# EAGLE design usb-current-meter-8x (EAGLE 6.3)
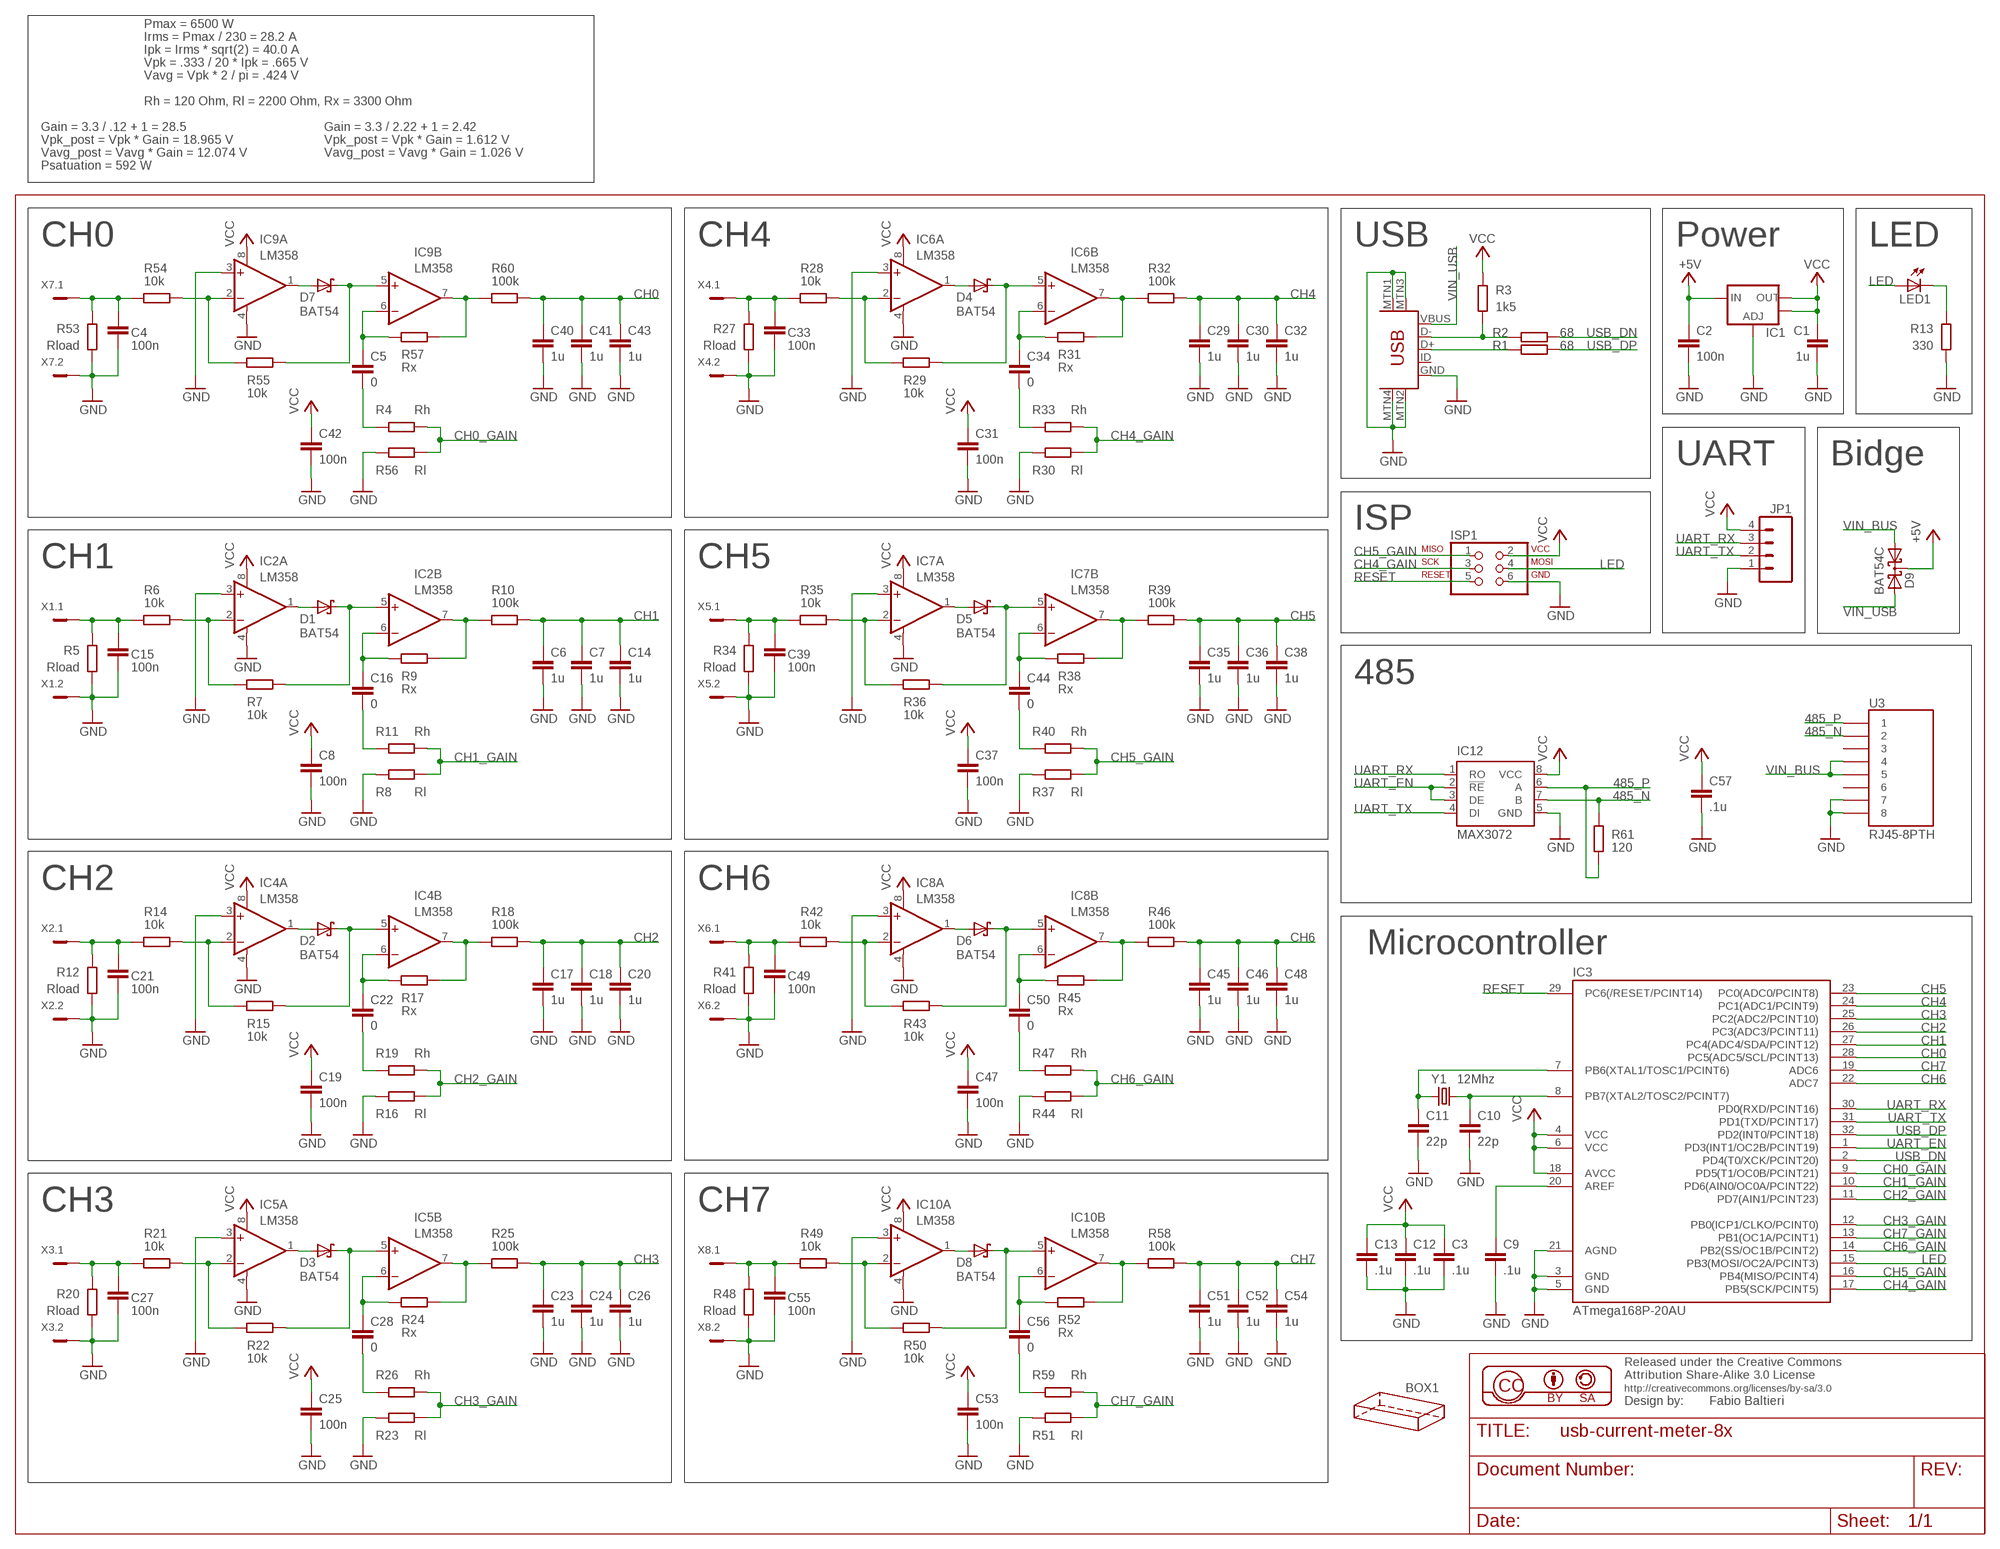
[diagram p0: schematic, sheet 1]

## Parts
BOX1  HAMMOND-BOX-XXA  [1591XXA]
C1  1u  C-EUC0805  [C0805]
C2  100n  C-EUC0805  [C0805]
C3  .1u  C-EUC0805  [C0805]
C4  100n  C-EUC0805  [C0805]
C5  0  C-EUC0805  [C0805]
C6  1u  C-EUC0805  [C0805]
C7  1u  C-EUC0805  [C0805]
C8  100n  C-EUC0805  [C0805]
C9  .1u  C-EUC0805  [C0805]
C10  22p  C-EUC0805  [C0805]
C11  22p  C-EUC0805  [C0805]
C12  .1u  C-EUC0805  [C0805]
C13  .1u  C-EUC0805  [C0805]
C14  1u  C-EUC0805  [C0805]
C15  100n  C-EUC0805  [C0805]
C16  0  C-EUC0805  [C0805]
C17  1u  C-EUC0805  [C0805]
C18  1u  C-EUC0805  [C0805]
C19  100n  C-EUC0805  [C0805]
C20  1u  C-EUC0805  [C0805]
C21  100n  C-EUC0805  [C0805]
C22  0  C-EUC0805  [C0805]
C23  1u  C-EUC0805  [C0805]
C24  1u  C-EUC0805  [C0805]
C25  100n  C-EUC0805  [C0805]
C26  1u  C-EUC0805  [C0805]
C27  100n  C-EUC0805  [C0805]
C28  0  C-EUC0805  [C0805]
C29  1u  C-EUC0805  [C0805]
C30  1u  C-EUC0805  [C0805]
C31  100n  C-EUC0805  [C0805]
C32  1u  C-EUC0805  [C0805]
C33  100n  C-EUC0805  [C0805]
C34  0  C-EUC0805  [C0805]
C35  1u  C-EUC0805  [C0805]
C36  1u  C-EUC0805  [C0805]
C37  100n  C-EUC0805  [C0805]
C38  1u  C-EUC0805  [C0805]
C39  100n  C-EUC0805  [C0805]
C40  1u  C-EUC0805  [C0805]
C41  1u  C-EUC0805  [C0805]
C42  100n  C-EUC0805  [C0805]
C43  1u  C-EUC0805  [C0805]
C44  0  C-EUC0805  [C0805]
C45  1u  C-EUC0805  [C0805]
C46  1u  C-EUC0805  [C0805]
C47  100n  C-EUC0805  [C0805]
C48  1u  C-EUC0805  [C0805]
C49  100n  C-EUC0805  [C0805]
C50  0  C-EUC0805  [C0805]
C51  1u  C-EUC0805  [C0805]
C52  1u  C-EUC0805  [C0805]
C53  100n  C-EUC0805  [C0805]
C54  1u  C-EUC0805  [C0805]
C55  100n  C-EUC0805  [C0805]
C56  0  C-EUC0805  [C0805]
C57  .1u  C-EUC0805  [C0805]
D1  BAT54  [SOT23]
D2  BAT54  [SOT23]
D3  BAT54  [SOT23]
D4  BAT54  [SOT23]
D5  BAT54  [SOT23]
D6  BAT54  [SOT23]
D7  BAT54  [SOT23]
D8  BAT54  [SOT23]
D9  BAT54C  [SOT23]
IC1  V_REG_LM1117SOT223  [SOT223]
IC2  LM358  OPA2234U  [SO08]
IC3  ATmega168P-20AU  MEGA48/88/168-AU  [TQFP32-08]
IC4  LM358  OPA2234U  [SO08]
IC5  LM358  OPA2234U  [SO08]
IC6  LM358  OPA2234U  [SO08]
IC7  LM358  OPA2234U  [SO08]
IC8  LM358  OPA2234U  [SO08]
IC9  LM358  OPA2234U  [SO08]
IC10  LM358  OPA2234U  [SO08]
IC12  MAX3072  LTC485S  [SOIC8]
ISP1  ISP-AVR910PTH  [2X03]
JP1  M04PTH  [1X04]
LED1  LEDSML0805  [SML0805]
R1  68  R-EU_R0603  [R0603]
R2  68  R-EU_R0603  [R0603]
R3  1k5  R-EU_R0603  [R0603]
R4  Rh  R-EU_R0603  [R0603]
R5  Rload  R-EU_R0805  [R0805]
R6  10k  R-EU_R0603  [R0603]
R7  10k  R-EU_R0603  [R0603]
R8  Rl  R-EU_R0603  [R0603]
R9  Rx  R-EU_R0603  [R0603]
R10  100k  R-EU_R0603  [R0603]
R11  Rh  R-EU_R0603  [R0603]
R12  Rload  R-EU_R0805  [R0805]
R13  330  R-EU_R0603  [R0603]
R14  10k  R-EU_R0603  [R0603]
R15  10k  R-EU_R0603  [R0603]
R16  Rl  R-EU_R0603  [R0603]
R17  Rx  R-EU_R0603  [R0603]
R18  100k  R-EU_R0603  [R0603]
R19  Rh  R-EU_R0603  [R0603]
R20  Rload  R-EU_R0805  [R0805]
R21  10k  R-EU_R0603  [R0603]
R22  10k  R-EU_R0603  [R0603]
R23  Rl  R-EU_R0603  [R0603]
R24  Rx  R-EU_R0603  [R0603]
R25  100k  R-EU_R0603  [R0603]
R26  Rh  R-EU_R0603  [R0603]
R27  Rload  R-EU_R0805  [R0805]
R28  10k  R-EU_R0603  [R0603]
R29  10k  R-EU_R0603  [R0603]
R30  Rl  R-EU_R0603  [R0603]
R31  Rx  R-EU_R0603  [R0603]
R32  100k  R-EU_R0603  [R0603]
R33  Rh  R-EU_R0603  [R0603]
R34  Rload  R-EU_R0805  [R0805]
R35  10k  R-EU_R0603  [R0603]
R36  10k  R-EU_R0603  [R0603]
R37  Rl  R-EU_R0603  [R0603]
R38  Rx  R-EU_R0603  [R0603]
R39  100k  R-EU_R0603  [R0603]
R40  Rh  R-EU_R0603  [R0603]
R41  Rload  R-EU_R0805  [R0805]
R42  10k  R-EU_R0603  [R0603]
R43  10k  R-EU_R0603  [R0603]
R44  Rl  R-EU_R0603  [R0603]
R45  Rx  R-EU_R0603  [R0603]
R46  100k  R-EU_R0603  [R0603]
R47  Rh  R-EU_R0603  [R0603]
R48  Rload  R-EU_R0805  [R0805]
R49  10k  R-EU_R0603  [R0603]
R50  10k  R-EU_R0603  [R0603]
R51  Rl  R-EU_R0603  [R0603]
R52  Rx  R-EU_R0603  [R0603]
R53  Rload  R-EU_R0805  [R0805]
R54  10k  R-EU_R0603  [R0603]
R55  10k  R-EU_R0603  [R0603]
R56  Rl  R-EU_R0603  [R0603]
R57  Rx  R-EU_R0603  [R0603]
R58  100k  R-EU_R0603  [R0603]
R59  Rh  R-EU_R0603  [R0603]
R60  100k  R-EU_R0603  [R0603]
R61  120  R-EU_R0603  [R0603]
U3  RJ45-8PTH  [RJ45-8]
U$1  USB-MINIB-5PIN  [USB-MINIB]
U$2  Fabio Baltieri  CREATIVE_COMMONS  [CREATIVE_COMMONS]
X1  MC2  [MC2]
X2  MC2  [MC2]
X3  MC2  [MC2]
X4  MC2  [MC2]
X5  MC2  [MC2]
X6  MC2  [MC2]
X7  MC2  [MC2]
X8  MC2  [MC2]
Y1  12Mhz  CRYSTALHC49UV  [HC49U-V]

## Nets
485_N: IC12.7(B) R61.1 U3.2
485_P: IC12.6(A) R61.2 U3.1
+5V: C2.1 D9.3(CC) IC1.3(IN)
CH0: C40.1 C41.1 C43.1 IC3.28(PC5(ADC5/SCL/PCINT13)) R60.2
CH0_GAIN: IC3.9(PD5(T1/OC0B/PCINT21)) R4.1 R56.2
CH0_IN: C4.1 R53.2 R54.1 X7.1
CH0_IN1: C15.1 R5.2 R6.1 X1.1
CH0_IN2: C21.1 R12.2 R14.1 X2.1
CH0_IN3: C33.1 R27.2 R28.1 X4.1
CH0_IN4: C39.1 R34.2 R35.1 X5.1
CH0_IN5: C55.1 R48.2 R49.1 X8.1
CH0_IN6: C27.1 R20.2 R21.1 X3.1
CH0_IN8: C49.1 R41.2 R42.1 X6.1
CH1: C6.1 C7.1 C14.1 IC3.27(PC4(ADC4/SDA/PCINT12)) R10.2
CH1_GAIN: IC3.10(PD6(AIN0/OC0A/PCINT22)) R8.2 R11.1
CH2: C17.1 C18.1 C20.1 IC3.26(PC3(ADC3/PCINT11)) R18.2
CH2_GAIN: IC3.11(PD7(AIN1/PCINT23)) R16.2 R19.1
CH3: C23.1 C24.1 C26.1 IC3.25(PC2(ADC2/PCINT10)) R25.2
CH3_GAIN: IC3.12(PB0(ICP1/CLKO/PCINT0)) R23.2 R26.1
CH4: C29.1 C30.1 C32.1 IC3.24(PC1(ADC1/PCINT9)) R32.2
CH4_GAIN: IC3.17(PB5(SCK/PCINT5)) ISP1.3 R30.2 R33.1
CH5: C35.1 C36.1 C38.1 IC3.23(PC0(ADC0/PCINT8)) R39.2
CH5_GAIN: IC3.16(PB4(MISO/PCINT4)) ISP1.1 R37.2 R40.1
CH6: C45.1 C46.1 C48.1 IC3.22(ADC7) R46.2
CH6_GAIN: IC3.14(PB2(SS/OC1B/PCINT2)) R44.2 R47.1
CH7: C51.1 C52.1 C54.1 IC3.19(ADC6) R58.2
CH7_GAIN: IC3.13(PB1(OC1A/PCINT1)) R51.2 R59.1
GND: C1.2 C2.2 C3.2 C4.2 C6.2 C7.2 C8.2 C9.2 C10.2 C11.2 C12.2 C13.2 C14.2 C15.2 C17.2 C18.2 C19.2 C20.2 C21.2 C23.2 C24.2 C25.2 C26.2 C27.2 C29.2 C30.2 C31.2 C32.2 C33.2 C35.2 C36.2 C37.2 C38.2 C39.2 C40.2 C41.2 C42.2 C43.2 C45.2 C46.2 C47.2 C48.2 C49.2 C51.2 C52.2 C53.2 C54.2 C55.2 C57.2 IC1.1(ADJ) IC2.3(A:+IN) IC2.4(A:V-) IC3.3(GND) IC3.5(GND) IC3.21(AGND) IC4.3(A:+IN) IC4.4(A:V-) IC5.3(A:+IN) IC5.4(A:V-) IC6.3(A:+IN) IC6.4(A:V-) IC7.3(A:+IN) IC7.4(A:V-) IC8.3(A:+IN) IC8.4(A:V-) IC9.3(A:+IN) IC9.4(A:V-) IC10.3(A:+IN) IC10.4(A:V-) IC12.5(GND) ISP1.6 JP1.1 R5.1 R8.1 R12.1 R13.1 R16.1 R20.1 R23.1 R27.1 R30.1 R34.1 R37.1 R41.1 R44.1 R48.1 R51.1 R53.1 R56.1 U3.7 U3.8 U$1.GND U$1.MTN1(MTN2) U$1.MTN2(MTN3) U$1.MTN3(MTN1) U$1.MTN4 X1.2 X2.2 X3.2 X4.2 X5.2 X6.2 X7.2 X8.2
LED: IC3.15(PB3(MOSI/OC2A/PCINT3)) ISP1.4 LED1.A
N$1: R2.1 R3.1 U$1.D-
N$2: R1.1 U$1.D+
N$3: LED1.C R13.2
N$4: C11.1 IC3.7(PB6(XTAL1/TOSC1/PCINT6)) Y1.1
N$5: C10.1 IC3.8(PB7(XTAL2/TOSC2/PCINT7)) Y1.2
N$6: C9.1 IC3.20(AREF)
N$7: C5.2 R4.2
N$8: IC2.2(A:-IN) R6.2 R7.1
N$9: D1.1(A) IC2.1(A:OUT)
N$10: D1.3(C) IC2.5(B:+IN) R7.2
N$11: C16.1 IC2.6(B:-IN) R9.1
N$12: IC2.7(B:OUT) R9.2 R10.1
N$13: C16.2 R11.2
N$14: IC4.2(A:-IN) R14.2 R15.1
N$15: D2.1(A) IC4.1(A:OUT)
N$16: D2.3(C) IC4.5(B:+IN) R15.2
N$17: C22.1 IC4.6(B:-IN) R17.1
N$18: IC4.7(B:OUT) R17.2 R18.1
N$19: C22.2 R19.2
N$20: IC6.2(A:-IN) R28.2 R29.1
N$21: D4.1(A) IC6.1(A:OUT)
N$22: D4.3(C) IC6.5(B:+IN) R29.2
N$23: C34.1 IC6.6(B:-IN) R31.1
N$24: IC6.7(B:OUT) R31.2 R32.1
N$25: C34.2 R33.2
N$26: IC7.2(A:-IN) R35.2 R36.1
N$27: D5.1(A) IC7.1(A:OUT)
N$28: D5.3(C) IC7.5(B:+IN) R36.2
N$29: C44.1 IC7.6(B:-IN) R38.1
N$30: IC7.7(B:OUT) R38.2 R39.1
N$31: C44.2 R40.2
N$32: IC10.2(A:-IN) R49.2 R50.1
N$33: D8.1(A) IC10.1(A:OUT)
N$34: D8.3(C) IC10.5(B:+IN) R50.2
N$35: C56.1 IC10.6(B:-IN) R52.1
N$36: IC10.7(B:OUT) R52.2 R58.1
N$37: IC9.2(A:-IN) R54.2 R55.1
N$38: D7.1(A) IC9.1(A:OUT)
N$39: D7.3(C) IC9.5(B:+IN) R55.2
N$40: C5.1 IC9.6(B:-IN) R57.1
N$41: IC9.7(B:OUT) R57.2 R60.1
N$42: C56.2 R59.2
N$43: IC5.2(A:-IN) R21.2 R22.1
N$44: D3.1(A) IC5.1(A:OUT)
N$45: D3.3(C) IC5.5(B:+IN) R22.2
N$46: C28.1 IC5.6(B:-IN) R24.1
N$47: IC5.7(B:OUT) R24.2 R25.1
N$48: C28.2 R26.2
N$55: IC8.2(A:-IN) R42.2 R43.1
N$56: D6.1(A) IC8.1(A:OUT)
N$57: D6.3(C) IC8.5(B:+IN) R43.2
N$58: C50.1 IC8.6(B:-IN) R45.1
N$59: IC8.7(B:OUT) R45.2 R46.1
N$60: C50.2 R47.2
RESET: IC3.29(PC6(/RESET/PCINT14)) ISP1.5
UART_EN: IC3.1(PD3(INT1/OC2B/PCINT19)) IC12.2(!RE) IC12.3(DE)
UART_RX: IC3.30(PD0(RXD/PCINT16)) IC12.1(RO) JP1.3
UART_TX: IC3.31(PD1(TXD/PCINT17)) IC12.4(DI) JP1.2
USB_DN: IC3.2(PD4(T0/XCK/PCINT20)) R2.2
USB_DP: IC3.32(PD2(INT0/PCINT18)) R1.2
VCC: C1.1 C3.1 C8.1 C12.1 C13.1 C19.1 C25.1 C31.1 C37.1 C42.1 C47.1 C53.1 C57.1 IC1.2(OUT) IC1.4(OUT) IC2.8(A:V+) IC3.4(VCC) IC3.6(VCC) IC3.18(AVCC) IC4.8(A:V+) IC5.8(A:V+) IC6.8(A:V+) IC7.8(A:V+) IC8.8(A:V+) IC9.8(A:V+) IC10.8(A:V+) IC12.8(VCC) ISP1.2 JP1.4 R3.2
VIN_BUS: D9.1(A1) U3.4 U3.5
VIN_USB: D9.2(A2) U$1.VBUS
Unconnected: U3.3 U3.6 U$1.ID

## Notes on the sheet
- Pmax = 6500 W
- Irms = Pmax / 230 = 28.2 A
- Ipk = Irms * sqrt(2) = 40.0 A
- Vpk = .333 / 20 * Ipk = .665 V
- Vavg = Vpk * 2 / pi = .424 V
- Rh = 120 Ohm, Rl = 2200 Ohm, Rx = 3300 Ohm
- Gain = 3.3 / .12 + 1 = 28.5 | Gain = 3.3 / 2.22 + 1 = 2.42
- Vpk_post = Vpk * Gain = 18.965 V | Vpk_post = Vpk * Gain = 1.612 V
- Vavg_post = Vavg * Gain = 12.074 V | Vavg_post = Vavg * Gain = 1.026 V
- Psatuation = 592 W
- CH0 | CH4 | USB | Power | LED
- UART | Bidge
- ISP
- CH1 | CH5
- 485
- CH2 | CH6
- Microcontroller
- CH3 | CH7

## Library data of the parts
BOX1 = hammond:HAMMOND-BOX: Hammond Project boxes Hammond 1551 Transluscent Blue 50x35x20mm 1551GTBU http://www.hammondmfg.com/pdf/1551G.pdf Hammond 1551 Transluscent Blue 50x50x20mm 1551RTBU http://www.hammondmfg.com/pdf/1551R.pdf Hammond 1551 Transluscent Blue 60x35x20mm 1551HTBU http://www.hammondmfg.com/pdf/1551H.pdf Hammond 1551 Transluscent Blue 80x40x20mm 1551KTBU http://www.hammondmfg.com/pdf/1551K.pdf Hammond 1591 Transluscent Blue 100x51x22m m 1591XXATBU http://www.hammondmfg.com/pdf/1591XXA.pdf
C1-C57 = rcl:C-EU: CAPACITOR, European symbol
D1-D8 = diode:BAT54: Schottky Diodes Source: Fairchild .. BAT54.pdf
D9 = diode:BAT54C: Schottky Diodes Source: Fairchild .. BAT54.pdf
IC1 = SparkFun:V_REG_LM1117: Voltage Regulator LM1117 Standard adjustable voltage regulator but in SMD form. Spark Fun Electronics SKU : COM-00595
IC2 IC4-IC10 = burr-brown:OPA2234: Operational Amplifier; MF: TEXAS INSTRUMENTS; MPN: OPA2234U; OC_FARNELL: 1212441; OC_NEWARK: 96K4523
IC3 = avr-5:MEGA48/88/168
IC12 = linear-technology:LTC485: Low Power RS485 Interface Transceiver Source: http://www.linear.com/pc/downloadDocument.do?navId=H0,C1,C1007,C1017,P2064,D1718; OC_FARNELL: unknown; OC_NEWARK: unknown
ISP1 = balto:ISP-AVR910: PIN HEADER
JP1 = SparkFun-Connectors:M04: Header 4 Standard 4-pin 0.1" header. Use with straight break away headers (SKU : PRT-00116), right angle break away headers (PRT-00553), swiss pins (PRT-00743), machine pins (PRT-00117), and female headers (PRT-00115). Molex polarized connector foot print use with SKU : PRT-08231 with associated crimp pins and housings. 1MM SMD Version SKU: PRT-10208
LED1 = led:LED: LED OSRAM: - CHIPLED LG R971, LG N971, LY N971, LG Q971, LY Q971, LO R971, LY R971 LH N974, LH R974 LS Q976, LO Q976, LY Q976 LO Q996 - Hyper CHIPLED LW Q18S LB Q993, LB Q99A, LB R99A - SideLED LS A670, LO A670, LY A670, LG A670, LP A670 LB A673, LV A673, LT A673, LW A673 LH A674 LY A675 LS A676, LA A676, LO A676, LY A676, LW A676 LS A679, LY A679, LG A679 - Hyper Micro SIDELED® LS Y876, LA Y876, LO Y876, LY Y876 LT Y87S - SmartLED LW L88C, LW L88S LB L89C, LB L89S, LG L890 LS L89K, LO L89K, LY L89K LS L896, LA L896, LO L896, LY L896 - TOPLED LS T670, LO T670, LY T670, LG T670, LP T670 LSG T670, LSP T670, LSY T670, LOP T670, LYG T670 LG T671, LOG T671, LSG T671 LB T673, LV T673, LT T673, LW T673 LH T674 LS T676, LA T676, LO T676, LY T676, LB T676, LH T676, LSB T676, LW T676 LB T67C, LV T67C, LT T67C, LS T67K, LO T67K, LY T67K, LW E67C LS E67B, LA E67B, LO E67B, LY E67B, LB E67C, LV E67C, LT E67C LW T67C LS T679, LY T679, LG T679 LS T770, LO T770, LY T770, LG T770, LP T770 LB T773, LV T773, LT T773, LW T773 LH T774 LS E675, LA E675, LY E675, LS T675 LS T776, LA T776, LO T776, LY T776, LB T776 LHGB T686 LT T68C, LB T68C - Hyper Mini TOPLED® LB M676 - Mini TOPLED Santana® LG M470 LS M47K, LO M47K, LY M47K Source: http://www.osram.convergy.de LUXEON: - LUMILED® LXK2-PW12-R00, LXK2-PW12-S00, LXK2-PW14-U00, LXK2-PW14-V00 LXK2-PM12-R00, LXK2-PM12-S00, LXK2-PM14-U00 LXK2-PE12-Q00, LXK2-PE12-R00, LXK2-PE12-S00, LXK2-PE14-T00, LXK2-PE14-U00 LXK2-PB12-K00, LXK2-PB12-L00, LXK2-PB12-M00, LXK2-PB14-N00, LXK2-PB14-P00, LXK2-PB14-Q00 LXK2-PR12-L00, LXK2-PR12-M00, LXK2-PR14-Q00, LXK2-PR14-R00 LXK2-PD12-Q00, LXK2-PD12-R00, LXK2-PD12-S00 LXK2-PH12-R00, LXK2-PH12-S00 LXK2-PL12-P00, LXK2-PL12-Q00, LXK2-PL12-R00 Source: www.luxeon.com KINGBRIGHT: KA-3528ASYC Source: www.kingbright.com
R1-R61 = rcl:R-EU_: RESISTOR, European symbol
U3 = SparkFun-Connectors:RJ45-8: RJ45 Jack Simple RJ45, 8-pin connection - connector for common Cat5, Cat5e, and Cat6 Ethernet cables. Footprint not yet proven in production. Connector sku is PRT-00643; Breakout PCB sku is BOB-00716.
U$1 = SparkFun:USB-MINIB: Mini-USB "B" connector with 5th pin broken out. Created new symbol breaking out 5th "ID" pin in mini/micro USB connector spec. See: http://en.wikipedia.org/wiki/Mini_usb#Cables. Uses same footprint as 4-pin symbol. Also added pins to connect to mounting / shield pads if required (probably not generally needed as signals aren't shielded once they leave the connector).
U$2 = balto:CREATIVE_COMMONS
X1-X8 = con-phoenix-381_l:MC2: Mini-Combicon 3.81mm horizontal 2-polig MC 1,5/2-G-3,81 Artikel-Nr. 1803277
Y1 = SparkFun:CRYSTAL: Crystals Various standard crystals. Proven footprints. Spark Fun Electronics SKU : COM-00534

## Board
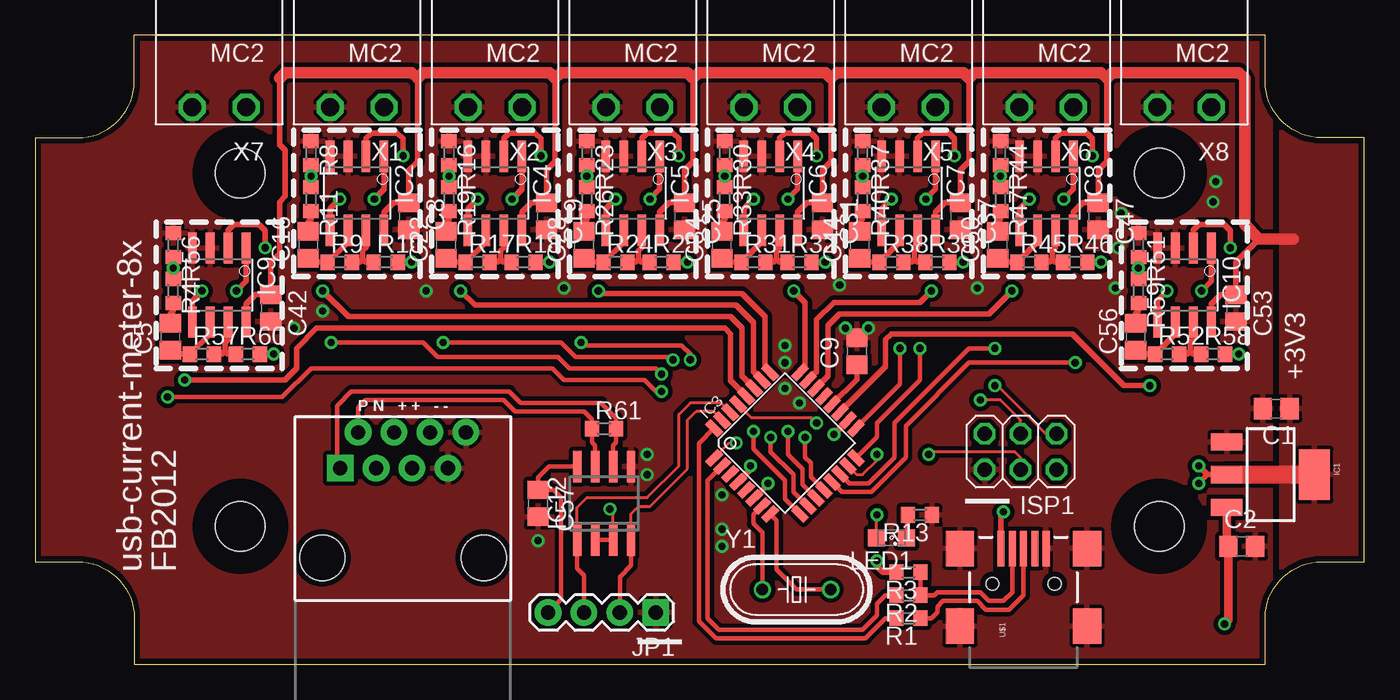
[diagram p1: board, top side]
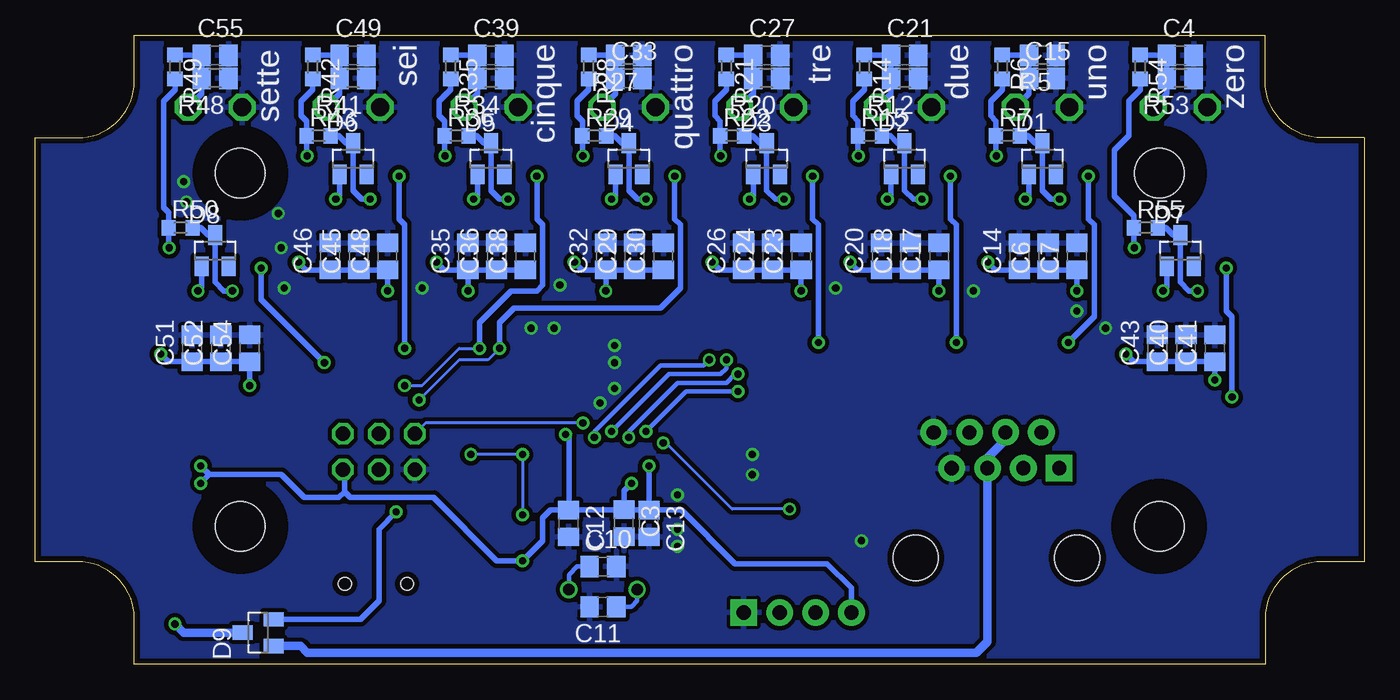
[diagram p2: board, bottom side, seen from below]

Size 94 x 44.5 mm. Coordinates in mm from the lower left corner, seen from the top.
Copper layers (1*16): Top 0.035mm / dielectric 1.5mm / Bottom 0.035mm
Design rules "default": minimum track width 8mil, minimum drill 20mil, track to track 8mil, track to pad 8mil, pad to pad 8mil, via to via 8mil, smd to smd 8mil, copper to edge 16mil, drill to drill 8mil, minimum pad ring 8mil, minimum via ring 8mil, stop-mask expansion 4mil, vias tented up to drill 20mil, thermal gap 10mil

### Footprints (pad centres in the part's own frame; a part is rotated, then mirrored left to right if it is on the bottom)
1591XXA = hole 3.5: 79.5,9.75; 14.5,34.75; 79.5,34.75; 14.5,9.75
C0805 = smd 1.3 x 1.5: 1 -0.95,0; 2 0.95,0
SOT23 = smd 1 x 1.4: 1 -0.95,-1.1; 2 0.95,-1.1; 3 0,1.1
SOT223 = smd 1.219 x 2.235: 1 -2.311,-3.099; 2 0,-3.099; 3 2.311,-3.099 | smd 3.6 x 2.2: 4 0,3.099
SO08 = smd 0.61 x 2.21: 1 -1.905,-2.616; 2 -0.635,-2.616; 3 0.635,-2.616; 4 1.905,-2.616; 5 1.905,2.616; 6 0.635,2.616; 7 -0.635,2.616; 8 -1.905,2.616
TQFP32-08 = smd 1.27 x 0.559: 1 -4.293,2.8; 2 -4.293,2; 3 -4.293,1.2; 4 -4.293,0.4; 5 -4.293,-0.4; 6 -4.293,-1.2; 7 -4.293,-2; 8 -4.293,-2.8; 17 4.293,-2.8; 18 4.293,-2; 19 4.293,-1.2; 20 4.293,-0.4; 21 4.293,0.4; 22 4.293,1.2; 23 4.293,2; 24 4.293,2.8 | smd 0.559 x 1.27: 9 -2.8,-4.293; 10 -2,-4.293; 11 -1.2,-4.293; 12 -0.4,-4.293; 13 0.4,-4.293; 14 1.2,-4.293; 15 2,-4.293; 16 2.8,-4.293; 25 2.8,4.293; 26 2,4.293; 27 1.2,4.293; 28 0.4,4.293; 29 -0.4,4.293; 30 -1.2,4.293; 31 -2,4.293; 32 -2.8,4.293
SOIC8 = smd 0.6 x 2.2: 1 -1.905,-2.6; 2 -0.635,-2.6; 3 0.635,-2.6; 4 1.905,-2.6; 5 1.905,2.6; 6 0.635,2.6; 7 -0.635,2.6; 8 -1.905,2.6
2X03 = drill 1.016 octagon: 1 -2.54,-1.27; 2 -2.54,1.27; 3 0,-1.27; 4 0,1.27; 5 2.54,-1.27; 6 2.54,1.27
1X04 = drill 1.016 pad 1.88 square: 1 0,0 | drill 1.016 pad 1.88: 2 2.54,0; 3 5.08,0; 4 7.62,0
SML0805 = smd 1.2 x 1.2: A 1.05,0; C -1.05,0
R0603 = smd 1 x 1.1: 1 -0.85,0; 2 0.85,0
R0805 = smd 1.3 x 1.5: 1 -0.95,0; 2 0.95,0
RJ45-8 = drill 1 pad 1.88 square: 1 -4.445,6.35 | drill 1 pad 1.88: 2 -3.175,8.89; 3 -1.905,6.35; 4 -0.635,8.89; 5 0.635,6.35; 6 1.905,8.89; 7 3.175,6.35; 8 4.445,8.89 | hole 3.2: -5.715,0; 5.715,0
USB-MINIB = smd 2.5 x 0.5: D+ 2.5,0; D- 2.5,0.8; GND 2.5,-1.6; ID 2.5,-0.8; VBUS 2.5,1.6 | smd 2.5 x 2: MTN1 -3,4.5; MTN2 2.5,4.5; MTN3 -3,-4.5; MTN4 2.5,-4.5 | hole 0.9: 0,2.2; 0,-2.2
MC2 = drill 1.27 octagon: 1 -1.905,0; 2 1.905,0
HC49U-V = drill 0.813: 1 -2.413,0; 2 2.413,0

### Placement (x,y rotation side)
BOX1  0,0 0 top
C1  87.78,18.08 180 top
C2  85.34,8.33 0 top
C3  52.37,9.98 270 bottom
C4  13,43.08 0 bottom
C5  9.55,23.16 90 top
C6  22.35,28.85 90 bottom
C7  20.32,28.85 90 bottom
C8  26.42,31.7 270 top
C9  58.12,22.15 90 top
C10  53.85,6.91 0 bottom
C11  53.85,4.06 180 bottom
C12  56.29,9.96 270 bottom
C13  50.6,9.96 270 bottom
C14  24.38,28.85 90 bottom
C15  22.76,41.45 0 bottom
C16  19.3,29.67 90 top
C17  30.07,28.85 90 bottom
C18  32.11,28.85 90 bottom
C19  36.17,31.7 270 top
C20  34.14,28.85 90 bottom
C21  32.51,43.08 0 bottom
C22  29.06,29.67 90 top
C23  39.83,28.85 90 bottom
C24  41.86,28.85 90 bottom
C25  45.92,31.7 270 top
C26  43.89,28.85 90 bottom
C27  42.27,43.08 0 bottom
C28  38.81,29.67 90 top
C29  51.61,28.85 90 bottom
C30  49.58,28.85 90 bottom
C31  55.68,31.7 270 top
C32  53.64,28.85 90 bottom
C33  52.02,41.45 0 bottom
C34  48.56,29.67 90 top
C35  63.4,28.85 90 bottom
C36  61.37,28.85 90 bottom
C37  65.43,31.7 270 top
C38  59.33,28.85 90 bottom
C39  61.77,43.08 0 bottom
C40  12.6,22.35 90 bottom
C41  10.57,22.35 90 bottom
C42  16.66,25.2 270 top
C43  14.63,22.35 90 bottom
C44  58.32,29.67 90 top
C45  71.12,28.85 90 bottom
C46  73.15,28.85 90 bottom
C47  75.18,31.7 270 top
C48  69.09,28.85 90 bottom
C49  71.53,43.08 0 bottom
C50  68.07,29.67 90 top
C51  82.91,22.35 90 bottom
C52  80.87,22.35 90 bottom
C53  84.94,25.2 270 top
C54  78.84,22.35 90 bottom
C55  81.28,43.08 0 bottom
C56  77.83,23.16 90 top
C57  35.56,11.38 270 top
D1  22.76,35.76 0 bottom
D2  32.51,35.76 0 bottom
D3  42.27,35.76 0 bottom
D4  52.02,35.76 0 bottom
D5  61.77,35.76 0 bottom
D6  71.53,35.76 0 bottom
D7  13,29.26 0 bottom
D8  81.28,29.26 0 bottom
D9  78.23,2.24 90 bottom
IC1  87.38,13.41 270 top
IC2  22.76,33.32 180 top
IC3  53.04,15.65 45 top
IC4  32.51,33.32 180 top
IC5  42.27,33.32 180 top
IC6  52.02,33.32 180 top
IC7  61.77,33.32 180 top
IC8  71.53,33.32 180 top
IC9  13,26.82 180 top
IC10  81.28,26.82 180 top
IC12  40.23,11.38 0 top
ISP1  69.7,15.04 180 top
JP1  43.89,3.66 180 top
LED1  60.55,8.94 180 top
R1  61.77,3.25 180 top
R2  61.77,4.88 180 top
R3  61.77,6.5 180 top
R4  9.75,26.42 270 top
R5  22.76,43.08 180 bottom
R6  25.6,42.27 270 bottom
R7  25.2,37.39 0 bottom
R8  19.51,36.17 270 top
R9  21.54,28.45 0 top
R10  24.79,28.45 0 top
R11  19.51,32.92 270 top
R12  32.51,41.45 180 bottom
R13  62.59,10.57 180 top
R14  35.36,42.27 270 bottom
R15  34.95,37.39 0 bottom
R16  29.26,36.17 270 top
R17  31.29,28.45 0 top
R18  34.54,28.45 0 top
R19  29.26,32.92 270 top
R20  42.27,41.45 180 bottom
R21  45.11,42.27 270 bottom
R22  44.7,37.39 0 bottom
R23  39.01,36.17 270 top
R24  41.05,28.45 0 top
R25  44.3,28.45 0 top
R26  39.01,32.92 270 top
R27  52.02,43.08 180 bottom
R28  54.86,42.27 270 bottom
R29  54.46,37.39 0 bottom
R30  48.77,36.17 270 top
R31  50.8,28.45 0 top
R32  54.05,28.45 0 top
R33  48.77,32.92 270 top
R34  61.77,41.45 180 bottom
R35  64.62,42.27 270 bottom
R36  64.21,37.39 0 bottom
R37  58.52,36.17 270 top
R38  60.55,28.45 0 top
R39  63.8,28.45 0 top
R40  58.52,32.92 270 top
R41  71.53,41.45 180 bottom
R42  74.37,42.27 270 bottom
R43  73.96,37.39 0 bottom
R44  68.28,36.17 270 top
R45  70.31,28.45 0 top
R46  73.56,28.45 0 top
R47  68.28,32.92 270 top
R48  81.28,41.45 180 bottom
R49  84.12,42.27 270 bottom
R50  83.72,30.89 0 bottom
R51  78.03,29.67 270 top
R52  80.06,21.95 0 top
R53  13,41.45 180 bottom
R54  15.85,42.27 270 bottom
R55  15.44,30.89 0 bottom
R56  9.75,29.67 270 top
R57  11.79,21.95 0 top
R58  83.31,21.95 0 top
R59  78.03,26.42 270 top
R60  15.04,21.95 0 top
R61  40.23,16.66 0 top
U3  26.01,7.52 0 top
U$1  69.9,5.69 90 top
U$2  8.33,1.22 0 top
X1  22.76,39.42 180 top
X2  32.51,39.42 180 top
X3  42.27,39.42 180 top
X4  52.02,39.42 180 top
X5  61.77,39.42 180 top
X6  71.53,39.42 180 top
X7  13,39.42 180 top
X8  81.28,39.42 180 top
Y1  53.85,5.28 0 top

### Tracks (layer width: path | path; a pad name or v marks a point on that pad's centre or on a via)
485_N
  Top 0.305: IC12.7 39.6,15.47 39.38,15.68 R61.1 39.38,17.31 38.81,17.88 33.93,17.88 33.12,18.69 23.37,18.69 22.84,18.16 U3.2
485_P
  Top 0.305: IC12.6 40.87,15.47 41.08,15.68 R61.2 41.08,17.44 40.03,18.49 34.34,18.49 33.53,19.3 22.35,19.3 21.34,18.29 21.34,14.1 U3.1
+5V  (via drill 0.51)
  Top 0.61: IC1.3 84.28,8.45 C2.1 84.39,3.11 v84.12,2.85
  Bottom 0.61: D9.3 83.52,2.23 v84.12,2.85
CH0  (via drill 0.51)
  Top 0.406: v16.87,21.95 R60.2 | IC3.28 49.17,20.07 49.17,23.37 48.77,23.77 19.91,23.77 18.49,22.35 18.49,20.93 17.68,20.12 v10.57,20.12
  Bottom 0.406: v16.87,21.95 16.32,21.4 C43.1 C40.1 C41.1 v10.57,20.12
CH0_GAIN  (via drill 0.51)
  Top 0.305: IC3.9 53.03,11.69 53.03,13.01 50.8,15.24 v50.8,16.46 | v44.3,19.3 43.89,19.3 43.08,20.12 37.39,20.12 36.58,20.93 19.51,20.93 17.48,18.9 v9.35,18.9
  Top 0.406: R4.1 v9.75,28.04 R56.2
  Bottom 0.305: v50.8,16.46 47.95,19.3 v44.3,19.3
  Bottom 0.406: v9.75,28.04 9.75,24.99 9.35,24.59 v9.35,18.9
CH0_IN
  Bottom 0.406: X7.1 13.96,40.38 R53.2 C4.1 15.81,43.08 R54.1
CH0_IN1
  Bottom 0.406: X1.1 23.71,40.38 C15.1 R5.2 25.6,43.08 R6.1
CH0_IN2
  Bottom 0.406: X2.1 33.46,40.38 R12.2 C21.1 35.36,43.08 R14.1
CH0_IN3
  Bottom 0.406: X4.1 52.97,40.38 C33.1 R27.2 54.86,43.08 R28.1
CH0_IN4
  Bottom 0.406: X5.1 62.72,40.38 R34.2 C39.1 64.62,43.08 R35.1
CH0_IN5
  Bottom 0.406: X8.1 82.23,40.38 R48.2 C55.1 84.12,43.08 R49.1
CH0_IN6
  Bottom 0.406: X3.1 43.22,40.38 R20.2 C27.1 45.11,43.08 R21.1
CH0_IN8
  Bottom 0.406: X6.1 72.48,40.38 R41.2 C49.1 74.37,43.08 R42.1
CH1  (via drill 0.51)
  Top 0.406: v26.62,28.45 R10.2 | v20.32,26.42 22.15,24.59 49.17,24.59 49.99,23.77 49.99,20.39 IC3.27
  Bottom 0.406: v26.62,28.45 26.08,27.9 C14.1 C6.1 C7.1 v20.32,26.42
CH1_GAIN  (via drill 0.51)
  Top 0.305: IC3.10 53.65,12.21 53.65,13.41 52.02,15.04 v52.02,16.05 | v44.3,20.52 43.89,20.93 37.8,20.93 36.98,21.74 28.45,21.74 27.43,22.76 v20.93,22.76
  Top 0.406: R11.1 v19.51,34.54 R8.2
  Bottom 0.305: v44.3,20.52 44.5,20.52 45.11,19.91 48.56,19.91 52.02,16.46 v52.02,16.05
  Bottom 0.406: v19.51,34.54 19.51,31.5 19.1,31.09 19.1,24.59 v20.93,22.76
CH2  (via drill 0.51)
  Top 0.406: v36.37,28.45 R18.2 | v30.07,26.42 31.09,25.4 49.58,25.4 50.8,24.18 50.8,20.71 IC3.26
  Bottom 0.406: v36.37,28.45 35.83,27.9 C20.1 C18.1 C17.1 v30.07,26.42
CH2_GAIN  (via drill 0.51)
  Top 0.305: IC3.11 54.25,12.73 54.25,13.82 53.24,14.83 v53.24,16.46 | v45.11,21.54 44.91,21.74 38.2,21.74 37.19,22.76 v28.85,22.76
  Top 0.406: R19.1 v29.26,34.54 R16.2
  Bottom 0.305: v53.24,16.46 49.17,20.52 45.52,20.52 45.11,20.93 v45.11,21.54
  Bottom 0.406: v29.26,34.54 29.26,31.5 28.85,31.09 v28.85,22.76
CH3  (via drill 0.51)
  Top 0.406: v46.13,28.45 R25.2 | v39.83,26.42 40.03,26.21 49.99,26.21 51.61,24.59 51.61,21.03 IC3.25
  Bottom 0.406: v46.13,28.45 45.58,27.9 C26.1 C24.1 C23.1 v39.83,26.42
CH3_GAIN  (via drill 0.51)
  Top 0.305: IC3.12 54.86,13.25 54.86,14.22 54.46,14.63 v54.46,16.05 | v46.33,21.54 46.33,21.95 45.72,22.55 38.81,22.55 v38.61,22.76
  Top 0.406: R26.1 v39.01,34.54 R23.2
  Bottom 0.305: v54.46,16.05 54.46,16.46 49.78,21.13 46.74,21.13 v46.33,21.54
  Bottom 0.406: v39.01,34.54 39.01,31.5 38.61,31.09 v38.61,22.76
CH4  (via drill 0.51)
  Top 0.406: v55.88,28.45 R32.2 | IC3.24 54.46,21.03 54.46,25.6 v53.65,26.42
  Bottom 0.406: C32.1 C29.1 C30.1 | C32.1 55.34,27.9 v55.88,28.45 | C32.1 v53.65,26.42
CH4_GAIN  (via drill 0.51)
  Top 0.203: ISP1.3 69.7,17.27 68.28,18.69 v66.85,18.69
  Top 0.305: IC3.17 61.16,19.82 v61.16,22.35
  Top 0.406: R33.1 v48.77,34.54 R30.2
  Bottom 0.203: v61.16,22.35 61.98,21.54 64.01,21.54 v66.85,18.69
  Bottom 0.406: v48.77,34.54 48.77,31.5 48.36,31.09 48.36,26.62 49.78,25.2 60.15,25.2 61.16,24.18 v61.16,22.35
CH5  (via drill 0.51)
  Top 0.406: v65.63,28.45 R39.2 | IC3.23 55.27,20.71 55.27,24.38 56.49,25.6 62.59,25.6 v63.4,26.42
  Bottom 0.406: C35.1 C36.1 C38.1 | C35.1 65.09,27.9 v65.63,28.45 | v63.4,26.42 C35.1
CH5_GAIN  (via drill 0.51)
  Top 0.203: v67.87,19.71 68.07,19.71 71.48,16.31 ISP1.1
  Top 0.305: IC3.16 59.54,16.08 59.54,17.07 62.59,20.12 v62.59,22.35
  Top 0.406: R40.1 v58.52,34.54 R37.2
  Bottom 0.203: v67.87,19.71 66.65,19.71 64.01,22.35 v62.59,22.35
  Bottom 0.406: v58.52,34.54 58.52,31.5 58.12,31.09 58.12,26.82 58.52,26.42 60.35,26.42 62.59,24.18 v62.59,22.35
CH6  (via drill 0.51)
  Top 0.406: v75.39,28.45 R46.2 | IC3.22 56.08,20.39 56.08,23.98 56.9,24.79 67.46,24.79 v69.09,26.42
  Bottom 0.406: v75.39,28.45 74.84,27.9 C46.1 C45.1 C48.1 v69.09,26.42
CH6_GAIN  (via drill 0.51)
  Top 0.305: IC3.14 57.58,12.8 58.93,12.8 60.76,14.63 60.76,17.07 66.04,22.35 v67.87,22.35
  Top 0.406: R47.1 v68.28,34.54 R44.2
  Bottom 0.406: v68.28,34.54 68.28,31.5 67.87,31.09 v67.87,22.35
CH7  (via drill 0.51)
  Top 0.406: v85.14,21.95 R58.2 | IC3.19 60.15,21.06 60.15,22.96 60.55,23.37 73.36,23.37 77.01,19.71 v78.84,19.71
  Bottom 0.406: v85.14,21.95 84.6,21.4 C51.1 C52.1 C54.1 v78.84,19.71
CH7_GAIN  (via drill 0.51)
  Top 0.305: IC3.13 57.05,12.19 59.13,12.19 61.57,14.63 61.57,16.87 66.04,21.34 v73.56,21.34
  Top 0.406: R59.1 v78.03,28.04 R51.2
  Bottom 0.406: v78.03,28.04 78.03,25.81 v73.56,21.34
GND  (via drill 0.51)
  other vias: 57.3,23.77 53.04,21.34 53.04,22.56 35.56,8.74 18.29,23.77 20.32,24.99 54.05,18.49 53.04,19.51 76.81,31.9 76.61,29.46 43.28,13.41 43.28,14.83 27.64,26.42 37.39,26.62 56.9,26.82 66.65,26.62 76.4,26.62 83.31,32.72 83.52,34.14 48.56,11.99 48.56,9.55 48.56,8.33 58.93,23.77
  pour Top (isolate 0.305): 0,0 87.38,0 87.38,44.3 0,44.3
  pour Bottom (isolate 0.305): 0,0 93.88,0 93.88,44.3 0,44.3
LED  (via drill 0.51)
  Top 0.203: IC3.15 58.1,13.41 58.52,13.41 59.54,14.43 v59.54,14.83 | LED1.A 59.5,10.53 v59.54,10.57 | ISP1.4 69.7,14.63 69.29,15.04 63.4,15.04 v63.2,14.83
  Bottom 0.203: v59.54,10.57 v59.54,14.83 v63.2,14.83
N$1
  Top 0.305: U$1.D- 69.1,5.09 68.48,4.47 67.46,4.47 66.85,5.08 63.8,5.08 63.6,4.88 R2.1 R3.1
N$2
  Top 0.305: U$1.D+ 69.9,4.88 68.89,3.86 67.26,3.86 66.65,4.47 64.21,4.47 63.8,4.06 63.8,3.66 63.4,3.25 R1.1
N$3
  Top 0.203: LED1.C 61.6,10.43 R13.2
N$4
  Top 0.305: Y1.1 51.44,9.32 50.8,9.96 50.8,10.58 IC3.7
  Bottom 0.305: C11.1 51.84,4.06 51.44,4.47 Y1.1
N$5
  Top 0.305: IC3.8 52.43,10.19 52.43,6.71 53.85,5.28 Y1.2
  Bottom 0.305: Y1.2 56.26,6.33 55.68,6.91 C10.1
N$6
  Top 0.406: IC3.20 58.12,20.16 C9.1
N$7
  Top 0.406: C5.2 9.55,24.79 9.75,24.99 R4.2
N$8  (via drill 0.51)
  Top 0.406: v26.01,35.97 26.01,37.19 25.6,37.59 23.77,37.59 23.39,37.21 IC2.2
  Bottom 0.406: R6.2 25.6,40.64 26.42,39.83 26.42,38.81 26.05,38.44 R7.1 26.05,36 v26.01,35.97
N$9  (via drill 0.51)
  Top 0.406: IC2.1 24.66,33.6 v23.98,32.92
  Bottom 0.406: D1.1 23.71,33.19 v23.98,32.92
N$10  (via drill 0.51)
  Top 0.406: IC2.5 20.85,32.23 v21.54,32.92
  Bottom 0.406: R7.2 23.77,37.39 23.25,36.86 D1.3 22.76,33.53 22.15,32.92 v21.54,32.92
N$11
  Top 0.406: C16.1 19.57,28.45 R9.1 22.12,29.88 IC2.6
N$12
  Top 0.406: IC2.7 23.39,29.49 23.16,29.26 23.16,28.65 | 23.16,28.65 23.37,28.45 R10.1 | R9.2 22.96,28.45 23.16,28.65
N$13
  Top 0.406: C16.2 19.3,31.29 19.51,31.5 R11.2
N$14  (via drill 0.51)
  Top 0.406: v35.76,35.97 35.76,37.19 35.36,37.59 33.53,37.59 33.15,37.21 IC4.2
  Bottom 0.406: R14.2 35.36,40.64 36.17,39.83 36.17,38.81 35.8,38.44 R15.1 35.8,36 v35.76,35.97
N$15  (via drill 0.51)
  Top 0.406: IC4.1 34.42,33.6 v33.73,32.92
  Bottom 0.406: D2.1 33.46,33.19 v33.73,32.92
N$16  (via drill 0.51)
  Top 0.406: IC4.5 30.61,32.23 v31.29,32.92
  Bottom 0.406: R15.2 33.53,37.39 33,36.86 D2.3 32.51,33.53 31.9,32.92 v31.29,32.92
N$17
  Top 0.406: C22.1 29.33,28.45 R17.1 31.88,29.88 IC4.6
N$18
  Top 0.406: IC4.7 33.15,29.49 32.92,29.26 32.92,28.65 | 32.92,28.65 33.12,28.45 R18.1 | R17.2 32.72,28.45 32.92,28.65
N$19
  Top 0.406: C22.2 29.06,31.29 29.26,31.5 R19.2
N$20  (via drill 0.51)
  Top 0.406: v55.27,35.97 55.27,37.19 54.86,37.59 53.03,37.59 52.65,37.21 IC6.2
  Bottom 0.406: R28.2 54.86,40.64 55.68,39.83 55.68,38.81 55.31,38.44 R29.1 55.31,36 v55.27,35.97
N$21  (via drill 0.51)
  Top 0.406: IC6.1 53.92,33.6 v53.24,32.92
  Bottom 0.406: D4.1 52.97,33.19 v53.24,32.92
N$22  (via drill 0.51)
  Top 0.406: IC6.5 50.11,32.23 v50.8,32.92
  Bottom 0.406: R29.2 53.03,37.39 52.51,36.86 D4.3 52.02,33.53 51.41,32.92 v50.8,32.92
N$23
  Top 0.406: C34.1 48.83,28.45 R31.1 51.38,29.88 IC6.6
N$24
  Top 0.406: IC6.7 52.65,29.49 52.43,29.26 52.43,28.65 | 52.43,28.65 52.63,28.45 R32.1 | R31.2 52.22,28.45 52.43,28.65
N$25
  Top 0.406: C34.2 48.56,31.29 48.77,31.5 R33.2
N$26  (via drill 0.51)
  Top 0.406: v65.02,35.97 65.02,37.19 64.62,37.59 62.79,37.59 62.41,37.21 IC7.2
  Bottom 0.406: R35.2 64.62,40.64 65.43,39.83 65.43,38.81 65.06,38.44 R36.1 65.06,36 v65.02,35.97
N$27  (via drill 0.51)
  Top 0.406: IC7.1 63.68,33.6 v62.99,32.92
  Bottom 0.406: D5.1 62.72,33.19 v62.99,32.92
N$28  (via drill 0.51)
  Top 0.406: IC7.5 59.87,32.23 v60.55,32.92
  Bottom 0.406: R36.2 62.79,37.39 62.26,36.86 D5.3 61.77,33.53 61.16,32.92 v60.55,32.92
N$29
  Top 0.406: C44.1 58.59,28.45 R38.1 61.14,29.88 IC7.6
N$30
  Top 0.406: IC7.7 62.41,29.49 62.18,29.26 62.18,28.65 | 62.18,28.65 62.38,28.45 R39.1 | R38.2 61.98,28.45 62.18,28.65
N$31
  Top 0.406: C44.2 58.32,31.29 58.52,31.5 R40.2
N$32  (via drill 0.51)
  Top 0.406: v84.53,29.46 84.53,30.68 84.12,31.09 82.3,31.09 81.92,30.71 IC10.2
  Bottom 0.406: R49.2 84.12,40.64 84.94,39.83 84.94,32.31 84.57,31.94 R50.1 84.57,29.5 v84.53,29.46
N$33  (via drill 0.51)
  Top 0.406: IC10.1 83.19,27.1 v82.5,26.42
  Bottom 0.406: D8.1 82.23,26.68 v82.5,26.42
N$34  (via drill 0.51)
  Top 0.406: IC10.5 79.38,25.73 v80.06,26.42
  Bottom 0.406: R50.2 82.3,30.89 81.77,30.36 D8.3 81.28,27.03 80.67,26.42 v80.06,26.42
N$35
  Top 0.406: C56.1 78.09,21.95 R52.1 80.64,23.38 IC10.6
N$36
  Top 0.406: IC10.7 81.92,22.99 81.69,22.76 81.69,22.15 | 81.69,22.15 81.89,21.95 R58.1 | R52.2 81.48,21.95 81.69,22.15
N$37  (via drill 0.51)
  Top 0.406: v16.26,29.46 16.26,30.68 15.85,31.09 14.02,31.09 13.64,30.71 IC9.2
  Bottom 0.406: R54.2 15.85,40.64 16.66,39.83 16.66,37.39 17.68,36.37 17.68,33.12 16.29,31.74 R55.1 16.29,29.5 v16.26,29.46
N$38  (via drill 0.51)
  Top 0.406: IC9.1 14.91,27.1 v14.22,26.42
  Bottom 0.406: D7.1 13.96,26.68 v14.22,26.42
N$39  (via drill 0.51)
  Top 0.406: IC9.5 11.1,25.73 v11.79,26.42
  Bottom 0.406: R55.2 14.02,30.89 13.49,30.36 D7.3 13.01,27.03 12.39,26.42 v11.79,26.42
N$40
  Top 0.406: C5.1 9.82,21.95 R57.1 12.37,23.38 IC9.6
N$41
  Top 0.406: IC9.7 13.64,22.99 13.41,22.76 13.41,22.15 | 13.41,22.15 13.61,21.95 R60.1 | R57.2 13.21,21.95 13.41,22.15
N$42
  Top 0.406: C56.2 77.83,24.79 78.03,24.99 R59.2
N$43  (via drill 0.51)
  Top 0.406: v45.52,35.97 45.52,37.19 45.11,37.59 43.28,37.59 42.9,37.21 IC5.2
  Bottom 0.406: R21.2 45.11,40.64 45.92,39.83 45.92,38.81 45.55,38.44 R22.1 45.55,36 v45.52,35.97
N$44  (via drill 0.51)
  Top 0.406: IC5.1 44.17,33.6 v43.48,32.92
  Bottom 0.406: D3.1 43.22,33.19 v43.48,32.92
N$45  (via drill 0.51)
  Top 0.406: IC5.5 40.36,32.23 v41.05,32.92
  Bottom 0.406: R22.2 43.28,37.39 42.76,36.86 D3.3 42.27,33.53 41.66,32.92 v41.05,32.92
N$46
  Top 0.406: C28.1 39.08,28.45 R24.1 41.63,29.88 IC5.6
N$47
  Top 0.406: IC5.7 42.9,29.49 42.67,29.26 42.67,28.65 | 42.67,28.65 42.88,28.45 R25.1 | R24.2 42.47,28.45 42.67,28.65
N$48
  Top 0.406: C28.2 38.81,31.29 39.01,31.5 R26.2
N$55  (via drill 0.51)
  Top 0.406: v74.78,35.97 74.78,37.19 74.37,37.59 72.54,37.59 72.16,37.21 IC8.2
  Bottom 0.406: R42.2 74.37,40.64 75.18,39.83 75.18,38.81 74.81,38.44 R43.1 74.81,36 v74.78,35.97
N$56  (via drill 0.51)
  Top 0.406: IC8.1 73.43,33.6 v72.75,32.92
  Bottom 0.406: D6.1 72.48,33.19 v72.75,32.92
N$57  (via drill 0.51)
  Top 0.406: IC8.5 69.62,32.23 v70.31,32.92
  Bottom 0.406: R43.2 72.54,37.39 72.02,36.86 D6.3 71.53,33.53 70.92,32.92 v70.31,32.92
N$58
  Top 0.406: C50.1 68.34,28.45 R45.1 70.89,29.88 IC8.6
N$59
  Top 0.406: IC8.7 72.16,29.49 71.93,29.26 71.93,28.65 | 71.93,28.65 72.14,28.45 R46.1 | R45.2 71.73,28.45 71.93,28.65
N$60
  Top 0.406: C50.2 68.07,31.29 68.28,31.5 R47.2
RESET  (via drill 0.51)
  Top 0.203: IC3.29 50.64,17.48 54.86,17.48 v55.27,17.07
  Bottom 0.203: v55.27,17.07 66.4,17.07 ISP1.5
UART_EN  (via drill 0.51)
  Top 0.203: IC12.3 40.87,10.74 v40.64,10.97 | 49.17,15.65 v49.58,15.65 49.08,15.65 IC3.1
  Top 0.305: IC12.2 IC12.3
  Bottom 0.203: v40.64,10.97 44.7,10.97 49.38,15.65 v49.58,15.65
UART_RX
  Top 0.203: IC12.1 38.33,11.1 39.01,11.79 43.28,11.79 45.52,14.02 45.52,17.68 46.33,18.49 48.49,18.49 IC3.30
  Top 0.305: IC12.1 38.33,6.78 38.81,6.3 JP1.3
UART_TX
  Top 0.203: IC12.4 42.14,10.64 42.67,11.18 43.48,11.18 46.13,13.82 46.13,17.27 46.74,17.88 47.97,17.88 IC3.31
  Top 0.305: JP1.2 41.35,6.2 42.14,6.99 IC12.4
USB_DN
  Top 0.305: IC3.2 47.55,12.99 47.55,3.25 48.36,2.44 58.52,2.44 59.54,3.45 59.54,4.27 60.15,4.88 R2.2
USB_DP
  Top 0.305: IC3.32 46.94,15.62 46.94,3.05 48.16,1.83 58.73,1.83 60.15,3.25 R1.2
VCC  (via drill 0.51)
  Top 0.305: IC12.8 36.33,13.98 35.56,13.21 C57.1 36.64,12.33 37.19,11.79 37.19,4.57 JP1.4
  Top 0.406: IC3.6 51.82,12.73 v51.82,12.8 | IC3.4 50.6,13.77 v50.6,14.02 | IC3.18 57.48,17.25 v56.49,16.26 | IC9.8 14.91,25.48 15.58,26.15 C42.1 16.66,28.45 17.27,29.06 17.27,32.72 17.68,33.12 17.68,36.37 17.27,36.78 17.27,41.45 | IC2.8 24.66,31.98 25.33,32.65 C8.1 26.42,34.95 27.03,35.56 27.03,41.45 | IC4.8 34.42,31.98 35.09,32.65 C19.1 36.17,34.95 36.78,35.56 36.78,41.45 | IC5.8 44.17,31.98 44.84,32.65 C25.1 45.92,34.95 46.53,35.56 46.53,41.45 | IC6.8 53.92,31.98 54.59,32.65 C31.1 55.68,34.95 56.29,35.56 56.29,41.45 | IC7.8 63.68,31.98 64.35,32.65 C37.1 65.43,34.95 66.04,35.56 66.04,41.45 | IC8.8 73.43,31.98 74.1,32.65 C47.1 75.18,34.95 75.79,35.56 75.79,41.45 | IC10.8 83.19,25.48 83.86,26.15 C53.1 84.94,28.45 86.56,30.07 | R3.2 59.94,6.5 59.54,6.91 v59.54,7.32 | IC1.2 82.91,13.41 | 82.91,13.41 v82.3,14.02 | 82.91,13.41 v82.3,12.8
  Top 0.813: 17.27,41.45 17.68,41.86 26.62,41.86 27.03,41.45 27.43,41.86 36.37,41.86 36.78,41.45 37.19,41.86 46.13,41.86 46.53,41.45 46.94,41.86 55.88,41.86 56.29,41.45 56.69,41.86 65.63,41.86 66.04,41.45 66.45,41.86 75.39,41.86 75.79,41.45 76.2,41.86 85.14,41.86 85.55,41.45 85.55,31.09 86.56,30.07 89,30.07
  Top 1.27: IC1.2 IC1.4
  Bottom 0.406: C13.1 52.34,10.91 C3.1 | C3.1 56.26,10.93 | 56.26,10.93 C12.1 57.57,10.91 58.12,10.36 58.12,8.74 v59.54,7.32 61.37,7.32 65.84,11.79 71.73,11.79 72.14,12.19 | C13.1 v50.6,14.02 | C3.1 52.37,12.25 v51.82,12.8 | 56.26,10.93 56.26,16.03 v56.49,16.26 | C13.1 48.3,10.91 44.5,7.11 38,7.11 36.27,5.38 JP1.4 | 72.14,12.19 72.54,11.79 74.98,11.79 76.61,13.41 81.69,13.41 | ISP1.2 72.14,13.66 72.14,12.19 | 81.69,13.41 v82.3,14.02 | 81.69,13.41 v82.3,12.8
  pour Top (isolate 0.305): 88.19,0 88.19,44.3 93.88,44.3 93.88,0
VIN_BUS
  Bottom 0.61: D9.1 75.25,1.28 74.78,0.81 27.43,0.81 26.64,1.6 U3.5 26.64,14.61 25.38,15.88 U3.4
VIN_USB  (via drill 0.51)
  Top 0.406: U$1.VBUS 68.3,10.59 v68.48,10.77
  Bottom 0.406: v68.48,10.77 69.7,9.55 69.7,4.47 70.98,3.19 D9.2

### Text on the board
_tsilk: +3V3 | P N + + - - | _ | usb-current-meter-8x | FB2012 | _
_bsilk: zero | uno | due | tre | quattro | cinque | sei | sette